# Altium project SecurePerformanceMonitor_Power1.PrjPcb
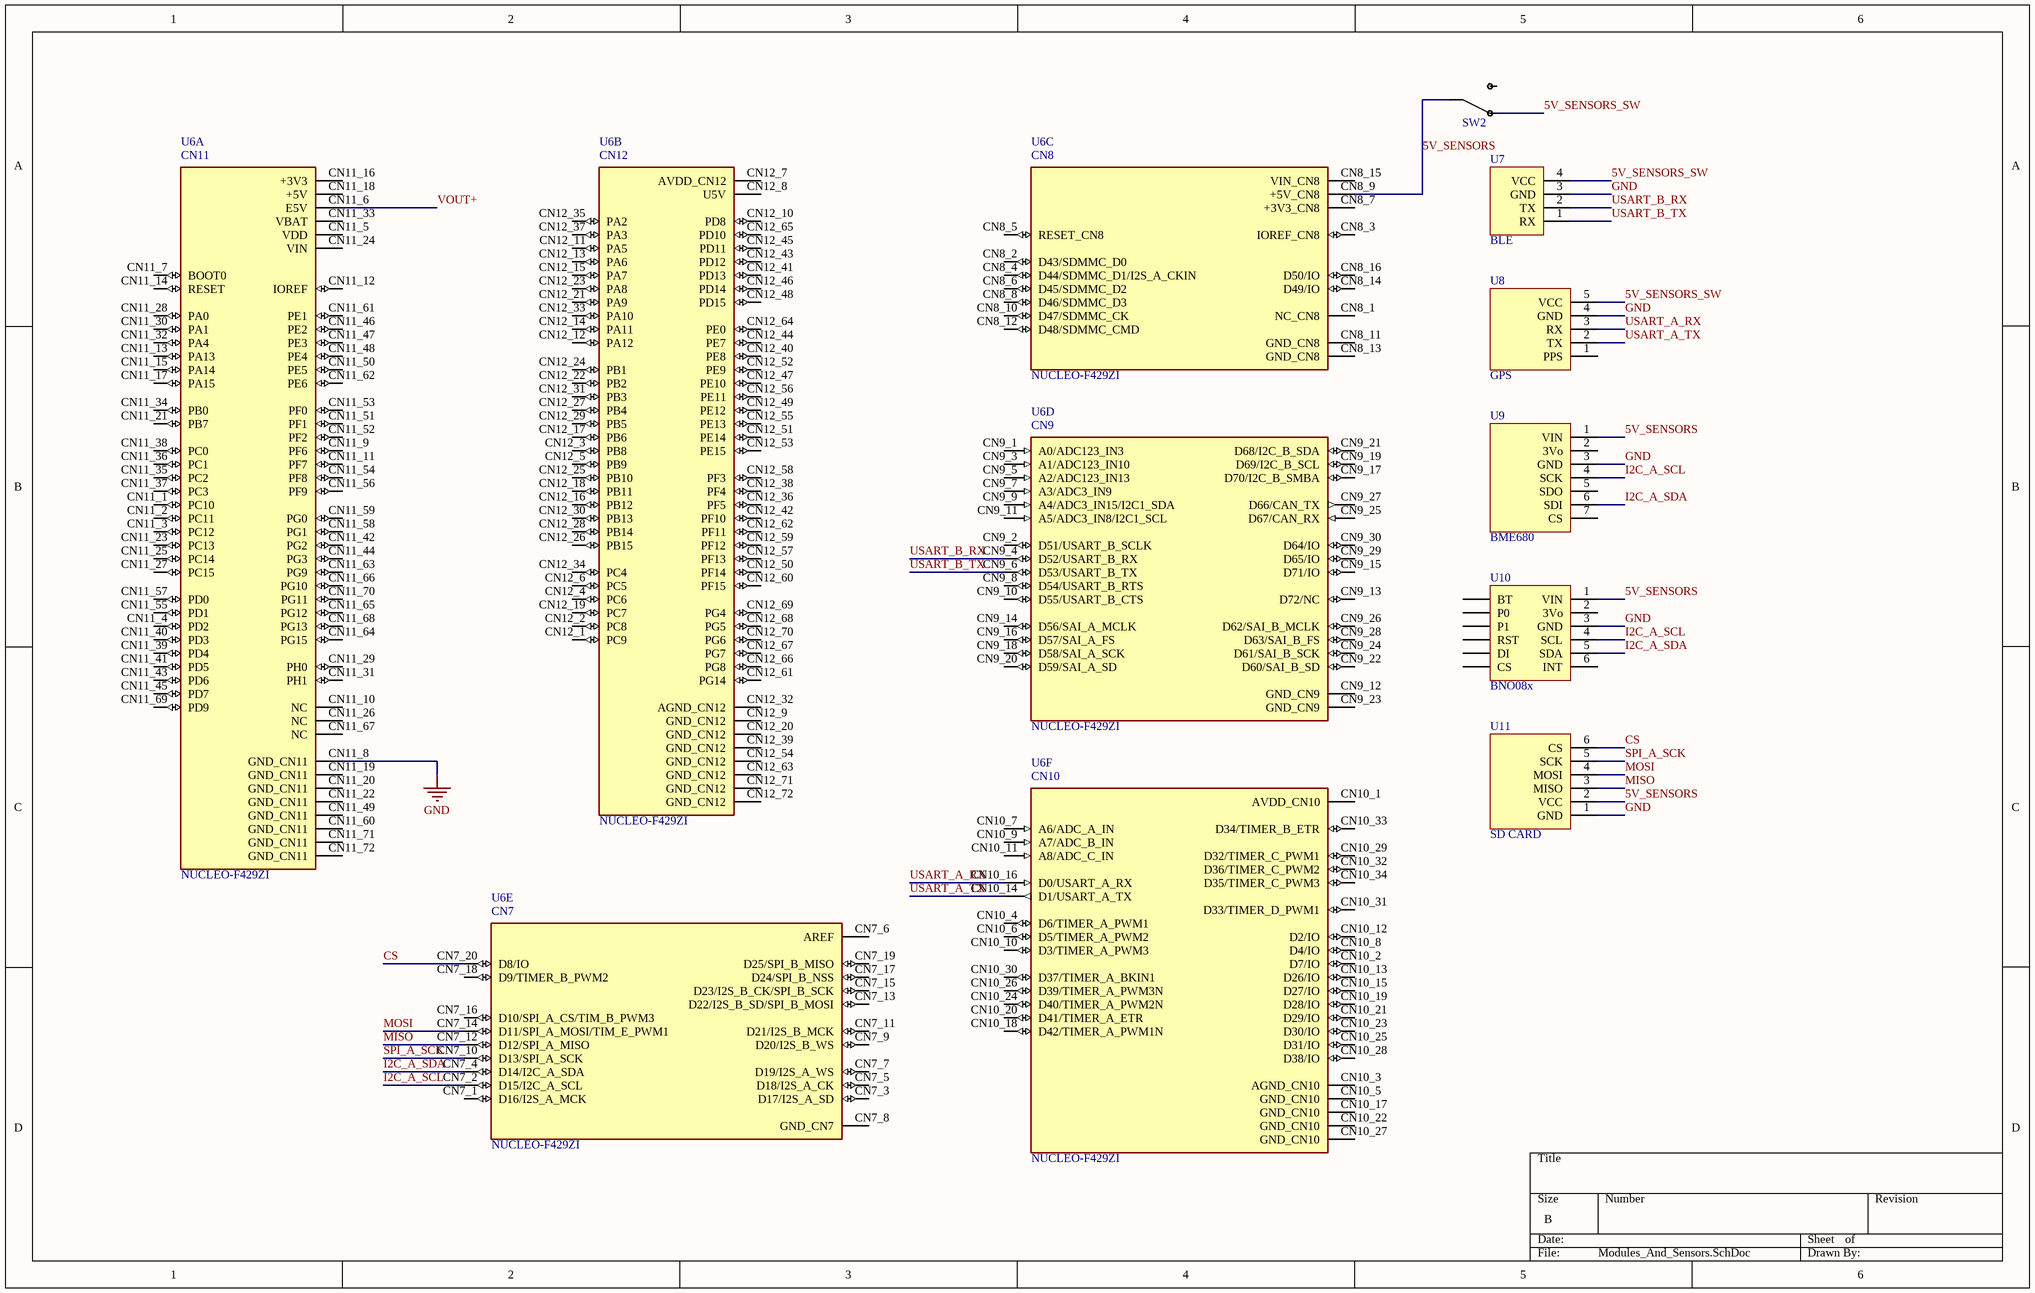
[diagram p0: Modules_And_Sensors.SchDoc]
2 sheets, 29 parts. Net scope: global (net labels, ports and power ports of the same name join across sheets).
Board file: Power_PCB.PcbDoc
Sheets:
  Modules_And_Sensors.SchDoc
  Power_schematic.SchDoc

## Sheet Modules_And_Sensors.SchDoc
size B; SheetNumber: 1; SheetTotal: 2

### Parts
SW2  SW  [SWITCH]  (value not drawn)
U6  NUCLEO-F429ZI  [MODULE_NUCLEO-F429ZI]  (parts A,B,C,D,E,F of 6)
U7  BLE  [BLE]
U8  GPS  [GPS]
U9  BME680  [BME680]
U10  BNO08x  [BNO08x]
U11  SD CARD  [SD CARD]

### Nets
GND: U6.CN11_8(GND_CN11) U7.3(GND) U8.4(GND) U9.3(GND) U10.3(GND) U11.1(GND)  [project net BAT-]
5V_SENSORS: SW2.2 U6.CN8_9(+5V_CN8) U9.1(VIN) U10.1(VIN) U11.2(VCC)
5V_SENSORS_SW: SW2.1 U7.4(VCC) U8.5(VCC)
CS: U6.CN7_20(D8/IO) U11.6(CS)
I2C_A_SCL: U6.CN7_2(D15/I2C_A_SCL) U9.4(SCK) U10.4(SCL)
I2C_A_SDA: U6.CN7_4(D14/I2C_A_SDA) U9.6(SDI) U10.5(SDA)
MISO: U6.CN7_12(D12/SPI_A_MISO) U11.3(MISO)
MOSI: U6.CN7_14(D11/SPI_A_MOSI/TIM_E_PWM1) U11.4(MOSI)
SPI_A_SCK: U6.CN7_10(D13/SPI_A_SCK) U11.5(SCK)
USART_A_RX: U6.CN10_16(D0/USART_A_RX) U8.3(RX)
USART_A_TX: U6.CN10_14(D1/USART_A_TX) U8.2(TX)
USART_B_RX: U6.CN9_4(D52/USART_B_RX) U7.2(TX)
USART_B_TX: U6.CN9_6(D53/USART_B_TX) U7.1(RX)
VOUT+: U6.CN11_6(E5V)

Not connected (* = marked no-connect by the designer): SW2 3(6); U6 CN7_1(D16/I2S_A_MCK) CN7_3(D17/I2S_A_SD) CN7_5(D18/I2S_A_CK) CN7_6(AREF) CN7_7(D19/I2S_A_WS) CN7_8(GND_CN7) CN7_9(D20/I2S_B_WS) CN7_11(D21/I2S_B_MCK) CN7_13(D22/I2S_B_SD/SPI_B_MOSI) CN7_15(D23/I2S_B_CK/SPI_B_SCK) CN7_16(D10/SPI_A_CS/TIM_B_PWM3) CN7_17(D24/SPI_B_NSS) CN7_18(D9/TIMER_B_PWM2) CN7_19(D25/SPI_B_MISO) CN8_1(NC_CN8) CN8_2(D43/SDMMC_D0) CN8_3(IOREF_CN8) CN8_4(D44/SDMMC_D1/I2S_A_CKIN) CN8_5(RESET_CN8) CN8_6(D45/SDMMC_D2) CN8_7(+3V3_CN8) CN8_8(D46/SDMMC_D3) CN8_10(D47/SDMMC_CK) CN8_11(GND_CN8) CN8_12(D48/SDMMC_CMD) CN8_13(GND_CN8) CN8_14(D49/IO) CN8_15(VIN_CN8) CN8_16(D50/IO) CN9_1(A0/ADC123_IN3) CN9_2(D51/USART_B_SCLK) CN9_3(A1/ADC123_IN10) CN9_5(A2/ADC123_IN13) CN9_7(A3/ADC3_IN9) CN9_8(D54/USART_B_RTS) CN9_9(A4/ADC3_IN15/I2C1_SDA) CN9_10(D55/USART_B_CTS) CN9_11(A5/ADC3_IN8/I2C1_SCL) CN9_12(GND_CN9) CN9_13(D72/NC) CN9_14(D56/SAI_A_MCLK) CN9_15(D71/IO) CN9_16(D57/SAI_A_FS) CN9_17(D70/I2C_B_SMBA) CN9_18(D58/SAI_A_SCK) CN9_19(D69/I2C_B_SCL) CN9_20(D59/SAI_A_SD) CN9_21(D68/I2C_B_SDA) CN9_22(D60/SAI_B_SD) CN9_23(GND_CN9) CN9_24(D61/SAI_B_SCK) CN9_25(D67/CAN_RX) CN9_26(D62/SAI_B_MCLK) CN9_27(D66/CAN_TX) CN9_28(D63/SAI_B_FS) CN9_29(D65/IO) CN9_30(D64/IO) CN10_1(AVDD_CN10) CN10_2(D7/IO) CN10_3(AGND_CN10) CN10_4(D6/TIMER_A_PWM1) CN10_5(GND_CN10) CN10_6(D5/TIMER_A_PWM2) CN10_7(A6/ADC_A_IN) CN10_8(D4/IO) CN10_9(A7/ADC_B_IN) CN10_10(D3/TIMER_A_PWM3) CN10_11(A8/ADC_C_IN) CN10_12(D2/IO) CN10_13(D26/IO) CN10_15(D27/IO) CN10_17(GND_CN10) CN10_18(D42/TIMER_A_PWM1N) CN10_19(D28/IO) CN10_20(D41/TIMER_A_ETR) CN10_21(D29/IO) CN10_22(GND_CN10) CN10_23(D30/IO) CN10_24(D40/TIMER_A_PWM2N) CN10_25(D31/IO) CN10_26(D39/TIMER_A_PWM3N) CN10_27(GND_CN10) CN10_28(D38/IO) CN10_29(D32/TIMER_C_PWM1) CN10_30(D37/TIMER_A_BKIN1) CN10_31(D33/TIMER_D_PWM1) CN10_32(D36/TIMER_C_PWM2) CN10_33(D34/TIMER_B_ETR) CN10_34(D35/TIMER_C_PWM3) CN11_1(PC10) CN11_2(PC11) CN11_3(PC12) CN11_4(PD2) CN11_5(VDD) CN11_7(BOOT0) CN11_9(PF6) CN11_10(NC) CN11_11(PF7) CN11_12(IOREF) CN11_13(PA13) CN11_14(RESET) CN11_15(PA14) CN11_16(+3V3) CN11_17(PA15) CN11_18(+5V) CN11_19(GND_CN11) CN11_20(GND_CN11) CN11_21(PB7) CN11_22(GND_CN11) CN11_23(PC13) CN11_24(VIN) CN11_25(PC14) CN11_26(NC) CN11_27(PC15) CN11_28(PA0) CN11_29(PH0) CN11_30(PA1) CN11_31(PH1) CN11_32(PA4) CN11_33(VBAT) CN11_34(PB0) CN11_35(PC2) CN11_36(PC1) CN11_37(PC3) CN11_38(PC0) CN11_39(PD4) CN11_40(PD3) CN11_41(PD5) CN11_42(PG2) CN11_43(PD6) CN11_44(PG3) CN11_45(PD7) CN11_46(PE2) CN11_47(PE3) CN11_48(PE4) CN11_49(GND_CN11) CN11_50(PE5) CN11_51(PF1) CN11_52(PF2) CN11_53(PF0) CN11_54(PF8) CN11_55(PD1) CN11_56(PF9) CN11_57(PD0) CN11_58(PG1) CN11_59(PG0) CN11_60(GND_CN11) CN11_61(PE1) CN11_62(PE6) CN11_63(PG9) CN11_64(PG15) CN11_65(PG12) CN11_66(PG10) CN11_67(NC) CN11_68(PG13) CN11_69(PD9) CN11_70(PG11) CN11_71(GND_CN11) CN11_72(GND_CN11) CN12_1(PC9) CN12_2(PC8) CN12_3(PB8) CN12_4(PC6) CN12_5(PB9) CN12_6(PC5) CN12_7(AVDD_CN12) CN12_8(U5V) CN12_9(GND_CN12) CN12_10(PD8) CN12_11(PA5) CN12_12(PA12) CN12_13(PA6) CN12_14(PA11) CN12_15(PA7) CN12_16(PB12) CN12_17(PB6) CN12_18(PB11) CN12_19(PC7) CN12_20(GND_CN12) CN12_21(PA9) CN12_22(PB2) CN12_23(PA8) CN12_24(PB1) CN12_25(PB10) CN12_26(PB15) CN12_27(PB4) CN12_28(PB14) CN12_29(PB5) CN12_30(PB13) CN12_31(PB3) CN12_32(AGND_CN12) CN12_33(PA10) CN12_34(PC4) CN12_35(PA2) CN12_36(PF5) CN12_37(PA3) CN12_38(PF4) CN12_39(GND_CN12) CN12_40(PE8) CN12_41(PD13) CN12_42(PF10) CN12_43(PD12) CN12_44(PE7) CN12_45(PD11) CN12_46(PD14) CN12_47(PE10) CN12_48(PD15) CN12_49(PE12) CN12_50(PF14) CN12_51(PE14) CN12_52(PE9) CN12_53(PE15) CN12_54(GND_CN12) CN12_55(PE13) CN12_56(PE11) CN12_57(PF13) CN12_58(PF3) CN12_59(PF12) CN12_60(PF15) CN12_61(PG14) CN12_62(PF11) CN12_63(GND_CN12) CN12_64(PE0) CN12_65(PD10) CN12_66(PG8) CN12_67(PG7) CN12_68(PG5) CN12_69(PG4) CN12_70(PG6) CN12_71(GND_CN12) CN12_72(GND_CN12); U8 1(PPS); U9 2(3Vo) 5(SDO) 7(CS); U10 2(3Vo) 6(INT) ?1(CS) ?2(DI) ?3(RST) ?4(P1) ?5(P0) ?6(BT)

### Notes on the sheet
- (in symbol NUCLEO-F429ZI, part A) CN11
- (in symbol NUCLEO-F429ZI, part B) CN12
- (in symbol NUCLEO-F429ZI, part C) CN8
- (in symbol NUCLEO-F429ZI, part D) CN9
- (in symbol NUCLEO-F429ZI, part E) CN7
- (in symbol NUCLEO-F429ZI, part F) CN10

### Library data of the parts
SW2 = Switch
U6 = NUCLEO-F429ZI: STM32F429ZI, mbed-Enabled Development Nucleo-144 STM32F4 ARMÂ® CortexÂ®-M4 MCU 32-Bit Embedded Evaluation Board; MF: STMicroelectronics; Check_prices: https://www.snapeda.com/parts/NUCLEO-F429ZI/STMicroelectronics/view-part/477252/?ref=eda; Availability: Bad; Value: *; Price: None; MP: NUCLEO-F429ZI; SnapEDA_Link: https://www.snapeda.com/parts/NUCLEO-F429ZI/STMicroelectronics/view-part/477252/?ref=snap; Package: None; Purchase-URL: https://pricing.snapeda.com/search/part/NUCLEO-F429ZI/?ref=eda

## Sheet Power_schematic.SchDoc
size A; SheetNumber: 2; SheetTotal: 2
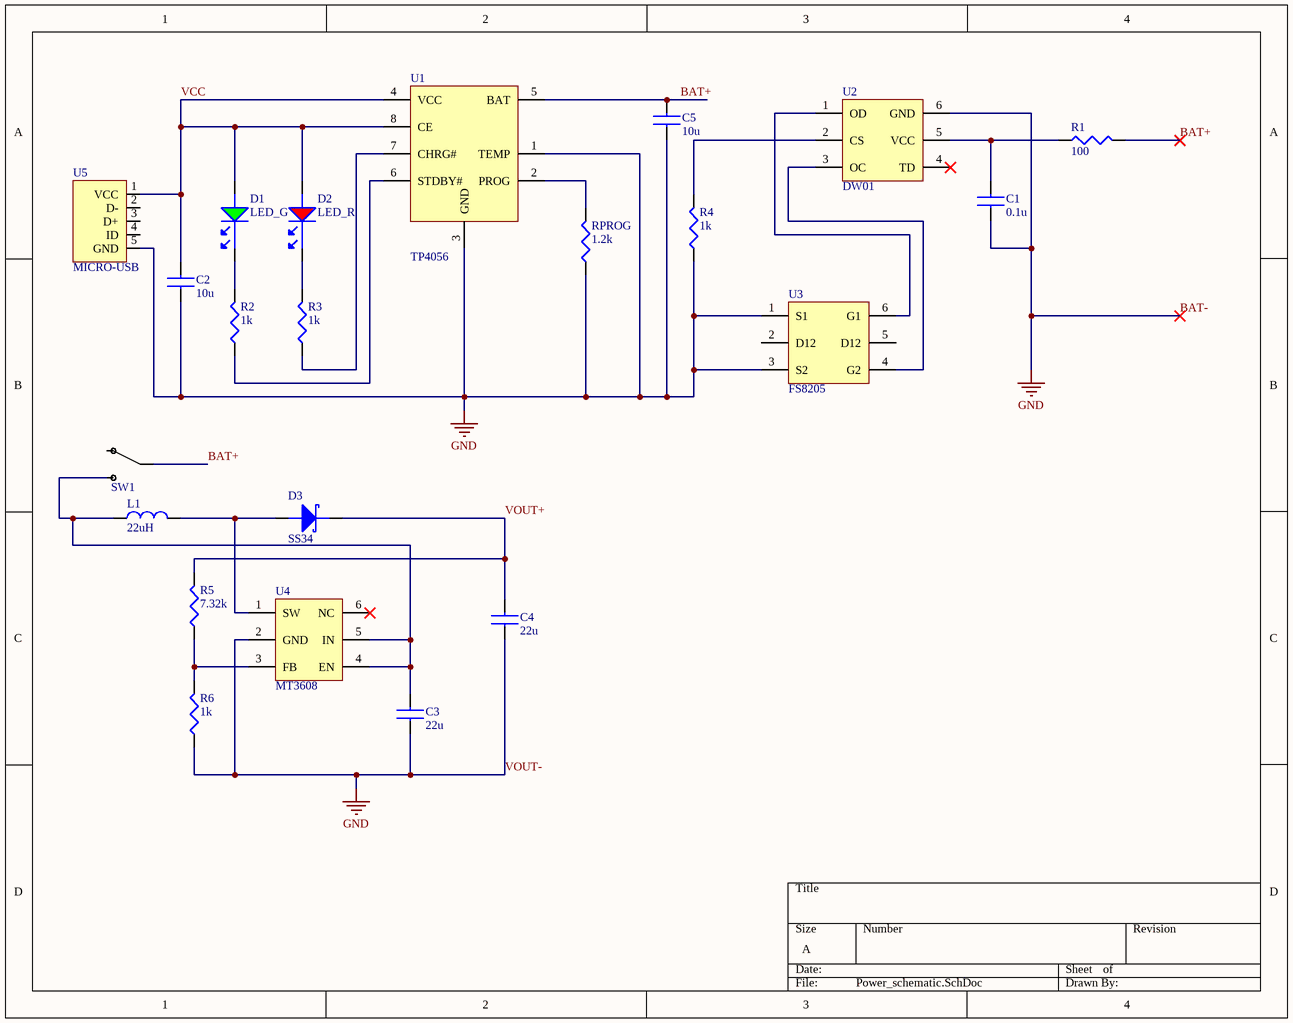
[diagram p1: Power_schematic.SchDoc]

### Parts
C1  0.1u  [CL03]
C2  10u  [CL21]
C3  22u  [CL10]
C4  22u  [CL10]
C5  10u  [CL21]
D1  LED_G  [SML-E12]
D2  LED_R  [SML-E12]
D3  SS34  [SS34]
L1  22uH  [CBC3225]
R1  100  [RMCP2010]
R2  1k  [RMCP2512]
R3  1k  [RMCP2512]
R4  1k  [RMCP2512]
R5  7.32k  [RMCP1206]
R6  1k  [RMCP2512]
RPROG  1.2k  [RMCP2512]
SW1  SW  [SWITCH]  (value not drawn)
U1  TP4056  [TP4056]
U2  DW01  [DW01]
U3  FS8205  [FS8205]
U4  MT3608  [MT3608]
U5  MICRO-USB  [USB]

### Nets
BAT-: C1.1 C2.1 C3.1 C4.1 C5.1 R4.1 R6.1 RPROG.1 U1.1(TEMP) U1.3(GND) U2.6(GND) U3.1(S1) U3.3(S2) U4.2(GND) U5.5(GND)  [also labelled GND, VOUT-]
BAT+: C5.2 R1.2 SW1.2 U1.5(BAT)
VCC: C2.2 D1.2 D2.2 U1.4(VCC) U1.8(CE) U5.1(VCC)
VOUT+: C4.2 D3.K R5.2
NetC1_2: C1.2 R1.1 U2.5(VCC)
NetC3_2: C3.2 L1.1 SW1.3 U4.4(EN) U4.5(IN)
NetD1_1: D1.1 R2.2
NetD2_1: D2.1 R3.2
NetD3_A: D3.A L1.2 U4.1(SW)
NetR2_1: R2.1 U1.6(STDBY#)
NetR3_1: R3.1 U1.7(CHRG#)
NetR4_2: R4.2 U2.2(CS)
NetR5_1: R5.1 R6.2 U4.3(FB)
NetRPROG_2: RPROG.2 U1.2(PROG)
NetU2_1: U2.1(OD) U3.6(G1)
NetU2_3: U2.3(OC) U3.4(G2)

Not connected (* = marked no-connect by the designer): SW1 1(7); U2 4(TD)*; U3 2(D12) 5(D12); U4 6(NC)*; U5 2(D-) 3(D+) 4(ID)

### Library data of the parts
C1 = 478-5052-1-ND: Cap Ceramic 0.1uF 6.3VDC X5R 10% SMD 0201 Paper T/R; Manufacturer: Samsung; Manufacturer Part Number: CL03A104KQ3NNNC; Capacitance: 100nF; Voltage Rating: 6.3V; Supplier 1: Digi-Key; RoHS: Yes; Category: Ceramic Capacitors; Stock 1: 6993845; Pricing 1: 1=0.10000, 10=0.01700, 50=0.00940, 100=0.00760, 500=0.00544, 1000=0.00427, 2500=0.00388, 5000=0.00357 (USD); Mount: Surface Mount; Case/Package: 0201; Case Code (Metric): 0603; Case Code (Imperial): 0201; Contact Plating: Tin; Min Operating Temperature: -55°C; Max Operating Temperature: 85°C; Tolerance: 10%; Package Quantity: 1; Packaging: Tape and Reel; Dielectric: X5R; Voltage: 6.3V; Voltage Rating (DC): 6.3V; Series: CL; Construction: Flat; Length: 0.6mm; Width: 0.012inch; Height: 0.3mm; Thickness: 0.013inch; Depth: 0.3mm; Radiation Hardening: No; Lead Free: Lead Free; ComponentLink1URL: https://datasheet.ciiva.com/15195/getdatasheetpartid-355266-15195551.pdf?src-supplier=Verical; ComponentLink1Description: https://datasheet.ciiva.com/15195/getdatasheetpartid-355266-15195551.pdf?src-supplier=Verical; ComponentLink2URL: https://datasheet.ciiva.com/16355/cl03a104kq3nnnc-16355155.pdf?src-supplier=Future+Electronics; ComponentLink2Description: https://datasheet.ciiva.com/16355/cl03a104kq3nnnc-16355155.pdf?src-supplier=Future+Electronics; ComponentLink3URL: https://datasheet.ciiva.com/26309/mlcc-catalogdownload2013-eng-26309017.pdf?src-supplier=Distrelec; ComponentLink3Description: https://datasheet.ciiva.com/26309/mlcc-catalogdownload2013-eng-26309017.pdf?src-supplier=Distrelec; Supplier Part Number 1: 1276-1013-1-ND
C2 C5 = CL21A106KQFNNNE: Cap Ceramic 10uF 6.3V X5R 10% SMD 0805 85C Embossed T/R; Manufacturer: Samsung; Supplier 1: Digi-Key; Manufacturer Part Number: CL21A106KQFNNNE; RoHS: Yes; Category: Ceramic Capacitors; Stock 1: 54959; Pricing 1: 1=0.12000, 10=0.09000, 50=0.04880, 100=0.03990, 500=0.02850, 1000=0.02239 (USD); Mount: Surface Mount; Case/Package: 0805; Case Code (Metric): 2012; Case Code (Imperial): 0805; Contact Plating: Tin; Min Operating Temperature: -55°C; Max Operating Temperature: 85°C; Tolerance: 10%; Packaging: Tape and Reel; Capacitance: 10uF; Package Quantity: 1; Voltage Rating: 6.3V; Dielectric: X5R; Voltage Rating (DC): 6.3V; Series: CL; Construction: Flat; Length: 2mm; Width: 0.049inch; Height: 1.25mm; Thickness: 0.053inch; Depth: 1.25mm; Radiation Hardening: No; Lead Free: Lead Free; RoHS Compliant: Yes; ComponentLink1URL: https://datasheet.ciiva.com/15195/getdatasheetpartid-39111-15195859.pdf?src-supplier=Verical; ComponentLink1Description: https://datasheet.ciiva.com/15195/getdatasheetpartid-39111-15195859.pdf?src-supplier=Verical; ComponentLink2URL: https://datasheet.ciiva.com/16294/cl05b104kq5nnnc-16294137.pdf?src-supplier=Future+Electronics; ComponentLink2Description: https://datasheet.ciiva.com/16294/cl05b104kq5nnnc-16294137.pdf?src-supplier=Future+Electronics; Supplier Part Number 1: 1276-1122-1-ND
C3 C4 = 1276-1013-1-ND: Cap Ceramic 22uF 6.3V X5R 20% SMD 0603 85°C Cardboard T/R; Manufacturer: Samsung; Manufacturer Part Number: CL10A226MQ8NRNC; Supplier 1: Digi-Key; RoHS: Yes; Category: Ceramic Capacitors; Stock 1: 950255; Pricing 1: 1=0.31000, 10=0.21000, 50=0.12600, 100=0.10640, 500=0.07280, 1000=0.06441 (USD); Mount: Surface Mount; Case/Package: 0603; Case Code (Metric): 1608; Case Code (Imperial): 0603; Material: Ceramic; Contact Plating: Tin; Min Operating Temperature: -55°C; Max Operating Temperature: 85°C; Capacitance: 22uF; Tolerance: 20%; Packaging: Tape and Reel; Voltage Rating: 6.3V; Package Quantity: 1; Dielectric: X5R; Voltage: 6.3V; Series: CL; Construction: Flat; Length: 1.6mm; Width: 0.031inch; Height: 0.8mm; Thickness: 0.039inch; Depth: 0.8mm; Radiation Hardening: No; RoHS Compliant: Yes; ComponentLink1URL: https://datasheet.ciiva.com/25790/cl10a226mq8nrnc-25790695.pdf?src-supplier=Digi-Key; ComponentLink1Description: https://datasheet.ciiva.com/25790/cl10a226mq8nrnc-25790695.pdf?src-supplier=Digi-Key; ComponentLink2URL: https://datasheet.ciiva.com/26838/getdatasheetpartid-353311-26838372.pdf?src-supplier=Verical; ComponentLink2Description: https://datasheet.ciiva.com/26838/getdatasheetpartid-353311-26838372.pdf?src-supplier=Verical; ComponentLink3URL: https://datasheet.ciiva.com/29198/457121-da-01-en-vs-kondensator-0603-29198747.pdf?src-supplier=Conrad; ComponentLink3Description: https://datasheet.ciiva.com/29198/457121-da-01-en-vs-kondensator-0603-29198747.pdf?src-supplier=Conrad; ComponentLink4URL: https://datasheet.ciiva.com/16437/cl05b104kq5nnnc-16437317.pdf?src-supplier=Future+Electronics; ComponentLink4Description: https://datasheet.ciiva.com/16437/cl05b104kq5nnnc-16437317.pdf?src-supplier=Future+Electronics; Supplier Part Number 1: 1276-1193-1-ND
D1 = SML-E12M8WT86: LED Uni-Color Yellow Green 2-Pin Chip LED T/R; Manufacturer: Rohm; Color: Green,Yellow; Lens Color: White; Forward Current: 20mA; Forward Voltage: 2.2V; Luminous Intensity: 25mcd; Viewing Angle: 140°; Lens Style: Diffused,Colorless,Rectangular; Dominant Wavelength: 572nm; Lens Transparency: Diffused; Number of LEDs: 1; Supplier 1: Digi-Key; Manufacturer Part Number: SML-E12M8WT86; RoHS: Yes; Category: LEDs; Stock 1: 6086; Pricing 1: 1=0.31000, 10=0.24400, 100=0.10940, 500=0.09884, 1000=0.08119, 2000=0.07060 (USD); Mount: Surface Mount; Case/Package: 0603; Number of Pins: 2; Case Code (Metric): 1608; Case Code (Imperial): 0603; Min Operating Temperature: -40°C; Max Operating Temperature: 85°C; Packaging: Tape and Reel; Package Quantity: 1; Series: EXCELED™; Illumination Color: Green; Test Current: 20mA; Wavelength: 572nm; Length: 1.6mm; Width: 0.8mm; Height: 0.46mm; Radiation Hardening: No; Lead Free: Lead Free; RoHS Compliant: Yes; ComponentLink1URL: https://datasheet.ciiva.com/16391/rohm20sml-e12m8wt86-16391779.pdf?src-supplier=Future+Electronics; ComponentLink1Description: https://datasheet.ciiva.com/16391/rohm20sml-e12m8wt86-16391779.pdf?src-supplier=Future+Electronics; ComponentLink2URL: https://datasheet.ciiva.com/2110/sml-e1-2110342.pdf?src-supplier=Digi-Key; ComponentLink2Description: https://datasheet.ciiva.com/2110/sml-e1-2110342.pdf?src-supplier=Digi-Key; ComponentLink3URL: https://datasheet.ciiva.com/2110/sml-e1-2110343.pdf?src-supplier=Digi-Key; ComponentLink3Description: https://datasheet.ciiva.com/2110/sml-e1-2110343.pdf?src-supplier=Digi-Key; ComponentLink4URL: https://datasheet.ciiva.com/2110/sml-e1-2110344.pdf?src-supplier=Digi-Key; ComponentLink4Description: https://datasheet.ciiva.com/2110/sml-e1-2110344.pdf?src-supplier=Digi-Key; Supplier Part Number 1: 511-1584-1-ND
D2 = SML-E12U8WT86: ROHM - SML-E12U8WT86 - LED, Rosso, SMD, 603, 20 mA, 2.2 V, 620 nm; Color: Red; Lens Color: White; Lens Style: Diffused,Colorless,Rectangular,Clear; Forward Voltage: 2.2V; Viewing Angle: 140°; Forward Current: 20mA; Luminous Intensity: 63mcd; Dominant Wavelength: 620nm; Lens Transparency: Diffused; Number of LEDs: 1; Supplier 1: Digi-Key; Supplier Part Number 1: 511-1586-1-ND; Manufacturer: Rohm; Manufacturer Part Number: SML-E12U8WT86; RoHS: Yes; Category: LEDs; Stock 1: 656; Pricing 1: 1=0.31000, 10=0.24400, 100=0.10940, 500=0.09884, 1000=0.08119, 2000=0.07060 (USD); Mount: Surface Mount; Case/Package: 0603; Number of Pins: 2; Case Code (Metric): 1608; Case Code (Imperial): 0603; Min Operating Temperature: -40°C; Max Operating Temperature: 85°C; Package Quantity: 1; Packaging: Tape and Reel; Series: EXCELED™; Illumination Color: Red; Test Current: 20mA; Wavelength: 620nm; Length: 1.6mm; Width: 0.8mm; Height: 0.46mm; Radiation Hardening: No; Lead Free: Lead Free; RoHS Compliant: Yes; ComponentLink1URL: https://datasheet.ciiva.com/2110/sml-e1-2110339.pdf?src-supplier=Digi-Key; ComponentLink1Description: https://datasheet.ciiva.com/2110/sml-e1-2110339.pdf?src-supplier=Digi-Key; ComponentLink2URL: https://datasheet.ciiva.com/2110/sml-e1-2110340.pdf?src-supplier=Digi-Key; ComponentLink2Description: https://datasheet.ciiva.com/2110/sml-e1-2110340.pdf?src-supplier=Digi-Key; ComponentLink3URL: https://datasheet.ciiva.com/2110/sml-e1-2110341.pdf?src-supplier=Digi-Key; ComponentLink3Description: https://datasheet.ciiva.com/2110/sml-e1-2110341.pdf?src-supplier=Digi-Key
D3 = SS34: DIODE SCHOTTKY 40V 3A SMC; Manufacturer: ON Semiconductor / Fairchild; Number of Terminals/Pins: 2; Max Reverse Current: 500uA; Max Surge Current: 100A; Element Configuration: Single; Polarity: Standard; Number of Elements: 1; Max Power Dissipation: 2.27W; Forward Voltage: 500mV; Supplier 1: Digi-Key; Manufacturer Part Number: SS34; RoHS: Yes; Category: Schottky Diodes; Stock 1: 16899; Pricing 1: 1=0.65000, 10=0.57500, 100=0.44120, 500=0.34874, 1000=0.28788 (USD); Mount: Surface Mount; Case/Package: SMC; Number of Pins: 2; Contact Plating: Tin,Matte; Min Operating Temperature: -55°C; Max Operating Temperature: 150°C; Packaging: Tape and Reel; Package Quantity: 1; Forward Current: 3A; Max Reverse Leakage Current: 500uA; Max Repetitive Reverse Voltage (Vrrm): 40V; Peak Non-Repetitive Surge Current: 100A; Voltage Rating (DC): 40V; Current Rating: 3A; Output Current: 3A; Average Rectified Current: 3A; Max Forward Surge Current (Ifsm): 100A; Current: 3A; Voltage: 40V; Max Reverse Voltage (DC): 40V; Length: 7.15mm; Width: 6.25mm; Height: 2.75mm; Radiation Hardening: No; REACH SVHC: No SVHC; Lead Free: Lead Free; RoHS Compliant: Yes; ComponentLink1URL: https://datasheet.ciiva.com/911/ss34-911088.pdf?src-supplier=Avnet; ComponentLink1Description: https://datasheet.ciiva.com/911/ss34-911088.pdf?src-supplier=Avnet; ComponentLink2URL: https://datasheet.ciiva.com/23832/1725604-23832651.pdf?src-supplier=Newark; ComponentLink2Description: https://datasheet.ciiva.com/23832/1725604-23832651.pdf?src-supplier=Newark; ComponentLink3URL: https://datasheet.ciiva.com/34301/1090087-34301975.pdf?src-supplier=Jameco; ComponentLink3Description: https://datasheet.ciiva.com/34301/1090087-34301975.pdf?src-supplier=Jameco; ComponentLink4URL: https://datasheet.ciiva.com/34302/1547649-34302462.pdf?src-supplier=Jameco; ComponentLink4Description: https://datasheet.ciiva.com/34302/1547649-34302462.pdf?src-supplier=Jameco; ComponentLink5URL: https://datasheet.ciiva.com/4715/ss34-197057-4715255.pdf?src-supplier=Mouser; ComponentLink5Description: https://datasheet.ciiva.com/4715/ss34-197057-4715255.pdf?src-supplier=Mouser; ComponentLink6URL: https://datasheet.ciiva.com/7965/1774678-7965245.pdf?src-supplier=Element14; ComponentLink6Description: https://datasheet.ciiva.com/7965/1774678-7965245.pdf?src-supplier=Element14; ComponentLink7URL: https://datasheet.ciiva.com/8300/ss39-8300583.pdf?src-supplier=Avnet; ComponentLink7Description: https://datasheet.ciiva.com/8300/ss39-8300583.pdf?src-supplier=Avnet; ComponentLink8URL: https://datasheet.ciiva.com/911/ss34-911086.pdf?src-supplier=Digi-Key; ComponentLink8Description: https://datasheet.ciiva.com/911/ss34-911086.pdf?src-supplier=Digi-Key; ComponentLink9URL: https://datasheet.ciiva.com/911/ss34-911087.pdf?src-supplier=Digi-Key; ComponentLink9Description: https://datasheet.ciiva.com/911/ss34-911087.pdf?src-supplier=Digi-Key; ComponentLink10URL: https://datasheet.ciiva.com/911/ss34-911085.pdf?src-supplier=Digi-Key; ComponentLink10Description: https://datasheet.ciiva.com/911/ss34-911085.pdf?src-supplier=Digi-Key; Supplier Part Number 1: SS34FSCT-ND
L1 = CBC3225T220MR: Inductor Power Chip Wirewound 22uH 20% 100KHz Ferrite 0.62A 0.351Ohm DCR 1210 T/R; Manufacturer: Taiyo Yuden; Self Resonant Frequency: 17MHz; Current Rating: 780mA; Saturation Current: 620mA; Shielding: Unshielded; DC Resistance (DCR): 351mR; Supplier 1: Mouser; Manufacturer Part Number: CBC3225T220MR; RoHS: Yes; Category: Fixed Inductors; Stock 1: 156168; Pricing 1: 1=0.31000, 10=0.22500, 50=0.22500, 100=0.18300, 1000=0.12800, 10000=0.10200 (USD); Mount: Surface Mount; Case/Package: 1210; Number of Pins: 2; Core Material: Ferrite; Case Code (Metric): 3225; Case Code (Imperial): 1210; Min Operating Temperature: -40°C; Max Operating Temperature: 105°C; Inductance Tolerance: 20%; Packaging: Tape and Reel; Package Quantity: 1000; Tolerance: 20%; Resistor Type: Wirewound; Inductance: 22uH; Test Frequency: 100kHz; Max DC Current: 780mA; Termination: SMD/SMT; DC Current: 780mA; Series: CB; Length: 0.126inch; Width: 0.098inch; Height: 2.5mm; Height - Seated (Max): 0.106inch; Depth: 2.7mm; Radiation Hardening: No; RoHS Compliant: Yes; REACH SVHC: Unknown; Military Standard: Not; Lead Free: Lead Free; Halogen Free: Halogen Free; ComponentLink1URL: https://datasheet.ciiva.com/8503/cbc3225t220mr-ss-8503638.pdf?src-supplier=Avnet; ComponentLink1Description: https://datasheet.ciiva.com/8503/cbc3225t220mr-ss-8503638.pdf?src-supplier=Avnet; ComponentLink2URL: https://datasheet.ciiva.com/15981/506cbc3225t220mr-15981705.pdf?src-supplier=Onlinecomponents.com; ComponentLink2Description: https://datasheet.ciiva.com/15981/506cbc3225t220mr-15981705.pdf?src-supplier=Onlinecomponents.com; ComponentLink3URL: https://datasheet.ciiva.com/22624/1697178-22624159.pdf?src-supplier=Element14; ComponentLink3Description: https://datasheet.ciiva.com/22624/1697178-22624159.pdf?src-supplier=Element14; ComponentLink4URL: https://datasheet.ciiva.com/26871/getdatasheetpartid-637427-26871177.pdf?src-supplier=Verical; ComponentLink4Description: https://datasheet.ciiva.com/26871/getdatasheetpartid-637427-26871177.pdf?src-supplier=Verical; ComponentLink5URL: https://datasheet.ciiva.com/7291/cbc3225t220mr-ss-7291520.pdf?src-supplier=Newark; ComponentLink5Description: https://datasheet.ciiva.com/7291/cbc3225t220mr-ss-7291520.pdf?src-supplier=Newark; ComponentLink6URL: https://datasheet.ciiva.com/28479/1521599-28479565.pdf?src-supplier=Element14; ComponentLink6Description: https://datasheet.ciiva.com/28479/1521599-28479565.pdf?src-supplier=Element14; Supplier Part Number 1: 963-CBC3225T220MR
R1 = RMCP2010JT100R: RES 100 OHM 1W 5% 2010; Manufacturer: Stackpole Electronics; Resistance: 100R; Temperature Coefficient: 100ppm/°C; Supplier 1: Digi-Key; Supplier Part Number 1: RMCP2010JT100RCT-ND; Manufacturer Part Number: RMCP2010JT100R; RoHS: Yes; Category: Chip SMD Resistors; Stock 1: 13184; Pricing 1: 1=0.41000, 10=0.29800, 100=0.11900, 1000=0.05865 (USD); Case/Package: 2010; Case Code (Metric): 5025; Case Code (Imperial): 2010; Min Operating Temperature: -55°C; Max Operating Temperature: 155°C; Package Quantity: 4000; Packaging: Tape and Reel; Tolerance: 5%; Resistor Type: Thick Film; Number of Terminations: 2; Max Power Dissipation: 1W; Series: RMCP; Length: 0.197inch; Width: 0.098inch; Height: 0.028inch; Lead Free: Lead Free; RoHS Compliant: Yes; ComponentLink1URL: https://www.seielect.com/Catalog/SEI-RMCF_RMCP.pdf?src-supplier=Digi-Key; ComponentLink1Description: https://www.seielect.com/Catalog/SEI-RMCF_RMCP.pdf?src-supplier=Digi-Key; ComponentLink2URL: https://www.seielect.com/catalog/SEI-Packaging.pdf?src-supplier=Digi-Key; ComponentLink2Description: https://www.seielect.com/catalog/SEI-Packaging.pdf?src-supplier=Digi-Key; ComponentLink3URL: https://www.seielect.com/Catalog/SEI-RMCF_RMCP.pdf?src-supplier=Avnet; ComponentLink3Description: https://www.seielect.com/Catalog/SEI-RMCF_RMCP.pdf?src-supplier=Avnet
R2-R4 R6 = RMCF2512JT1K00: Res Thick Film 2512 1K Ohm 5% 1W ±200ppm/°C Molded SMD Plastic T/R; Manufacturer: Stackpole Electronics; Resistance: 1kR; Supplier 1: Digi-Key; Manufacturer Part Number: RMCF2512JT1K00; RoHS: Yes; Category: Chip SMD Resistors; Stock 1: 61639; Pricing 1: 1=0.30000, 10=0.25300, 100=0.09890, 1000=0.04140 (USD); Mount: Surface Mount; Case/Package: 2512; Case Code (Metric): 6432; Case Code (Imperial): 2512; Contact Plating: Tin,Matte; Size Code: 2512; Min Operating Temperature: -55°C; Max Operating Temperature: 155°C; Power Rating: 1W; Tolerance: 5%; Packaging: Tape and Reel; Resistor Type: Thick Film; Number of Terminations: 2; Max Power Dissipation: 1W; Temperature Coefficient: 200ppm/°C; Features: Automotive AEC-Q200; Series: RMCF; Construction: Rectangular; Length: 6.3mm; Width: 0.126inch; Height: 0.028inch; Depth: 3.2mm; Radiation Hardening: No; Lead Free: Lead Free; Military Standard: Not; RoHS Compliant: Yes; ComponentLink1URL: https://datasheet.ciiva.com/15193/getdatasheetpartid-368669-15193877.pdf?src-supplier=Verical; ComponentLink1Description: https://datasheet.ciiva.com/15193/getdatasheetpartid-368669-15193877.pdf?src-supplier=Verical; Supplier Part Number 1: RMCF2512JT1K00CT-ND
R5 = RMCF1206FT7K32: RES SMD 7.32K OHM 1% 1/4W 1206; Manufacturer: Stackpole Electronics; Resistance: 7.32kR; Max Power Dissipation: 250mW; Temperature Coefficient: 100ppm/°C; Supplier 1: Digi-Key; Supplier Part Number 1: RMCF1206FT7K32CT-ND; Manufacturer Part Number: RMCF1206FT7K32; RoHS: Yes; Category: Chip SMD Resistors; Stock 1: 3049; Pricing 1: 1=0.10000, 10=0.03600, 100=0.01460, 1000=0.00655, 2500=0.00569 (USD); Mount: Surface Mount; Case/Package: 1206; Case Code (Metric): 3216; Case Code (Imperial): 1206; Contact Plating: Tin,Matte; Min Operating Temperature: -55°C; Max Operating Temperature: 155°C; Tolerance: 1%; Features: Automotive AEC-Q200; Series: RMCF; Packaging: Tape and Reel; Resistor Type: Thick Film; Number of Terminations: 2; Length: 0.126inch; Width: 0.063inch; Height: 0.028inch; Radiation Hardening: No; RoHS Compliant: Yes; ComponentLink1URL: http://components.arrow.com/part/dataview/50583323S134593N1174?src-supplier=Arrow+Electronics; ComponentLink1Description: http://components.arrow.com/part/dataview/50583323S134593N1174?src-supplier=Arrow+Electronics; ComponentLink2URL: https://www.seielect.com/catalog/SEI-RMCF_RMCP.pdf?src-supplier=Avnet; ComponentLink2Description: https://www.seielect.com/catalog/SEI-RMCF_RMCP.pdf?src-supplier=Avnet; ComponentLink3URL: https://www.seielect.com/Catalog/SEI-RMCF_RMCP.pdf?src-supplier=Digi-Key; ComponentLink3Description: https://www.seielect.com/Catalog/SEI-RMCF_RMCP.pdf?src-supplier=Digi-Key; ComponentLink4URL: https://www.seielect.com/catalog/SEI-Packaging.pdf?src-supplier=Digi-Key; ComponentLink4Description: https://www.seielect.com/catalog/SEI-Packaging.pdf?src-supplier=Digi-Key
RPROG = RMCF2512JT1K20: Res Thick Film 2512 1.2K Ohm 5% 1W 100ppm/C Molded SMD SMD Plastic T/R; Manufacturer: Stackpole Electronics; Resistance: 1.2kR; Temperature Coefficient: 100ppm/°C; Supplier 1: Digi-Key; Supplier Part Number 1: RMCF2512JT1K20CT-ND; Manufacturer Part Number: RMCF2512JT1K20; RoHS: Yes; Category: Chip SMD Resistors; Stock 1: 2092; Pricing 1: 1=0.30000, 10=0.25300, 100=0.09890, 1000=0.04140 (USD); Mount: Surface Mount; Case/Package: 2512; Contact Plating: Tin,Matte; Size Code: 2512; Min Operating Temperature: -55°C; Max Operating Temperature: 155°C; Package Quantity: 4000; Packaging: Tape and Reel; Tolerance: 5%; Power Rating: 1W; Resistor Type: Thick Film; Number of Terminations: 2; Max Power Dissipation: 1W; Features: Automotive AEC-Q200; Series: RMCF; Construction: Rectangular; Length: 0.248inch; Width: 0.126inch; Height: 0.028inch; Depth: 3.2mm; Radiation Hardening: No; Military Standard: Not; Lead Free: Lead Free; RoHS Compliant: Yes; ComponentLink1URL: https://datasheet.ciiva.com/15193/getdatasheetpartid-408032-15193878.pdf?src-supplier=Verical; ComponentLink1Description: https://datasheet.ciiva.com/15193/getdatasheetpartid-408032-15193878.pdf?src-supplier=Verical
SW1 = Switch
U5 = USB3090-30-A: Micro A/b Skt, Bottom-smt, R/a, 3; Manufacturer: Global Connector Technology; Gender: Receptacle; Number of Contacts: 5; USB Standard: USB 2.0; Supplier 1: Newark; Manufacturer Part Number: USB3090-30-A; RoHS: Yes; Category: USB Connectors; Stock 1: 1500; Pricing 1: 1=0.92100, 1500=0.88200, 3000=0.70900, 7500=0.63800, 10500=0.58100, 15000=0.53200 (USD); Contact Material: Copper Alloy; Contact Plating: Gold; Weight: 0.001lb; Connector Type: USB; Termination: SMD/SMT; Number of Positions: 5; Orientation: Right Angle; Series: USB3090; Length: 0.525inch; Width: 0.525inch; Height: 0.525inch; REACH SVHC: No SVHC; Lead Free: Lead Free; RoHS Compliant: Yes; ComponentLink1URL: https://datasheet.ciiva.com/6743/usb3090-6743569.pdf?src-supplier=Newark; ComponentLink1Description: https://datasheet.ciiva.com/6743/usb3090-6743569.pdf?src-supplier=Newark; ComponentLink2URL: https://datasheet.ciiva.com/16502/usb3090-16502726.pdf?src-supplier=Future+Electronics; ComponentLink2Description: https://datasheet.ciiva.com/16502/usb3090-16502726.pdf?src-supplier=Future+Electronics; ComponentLink3URL: https://datasheet.ciiva.com/7633/1912470-7633851.pdf?src-supplier=Element14; ComponentLink3Description: https://datasheet.ciiva.com/7633/1912470-7633851.pdf?src-supplier=Element14; Supplier Part Number 1: 24AC9900

## Nets that join several sheets
BAT-: Modules_And_Sensors (6 pins), Power_schematic (15 pins)
VOUT+: Modules_And_Sensors (U6.CN11_6), Power_schematic (C4.2 D3.K R5.2)